# EAGLE design stepper_driver1_c (EAGLE 6.5.0)
stepper conroller with 2 counting bits for unipolar stepper motor
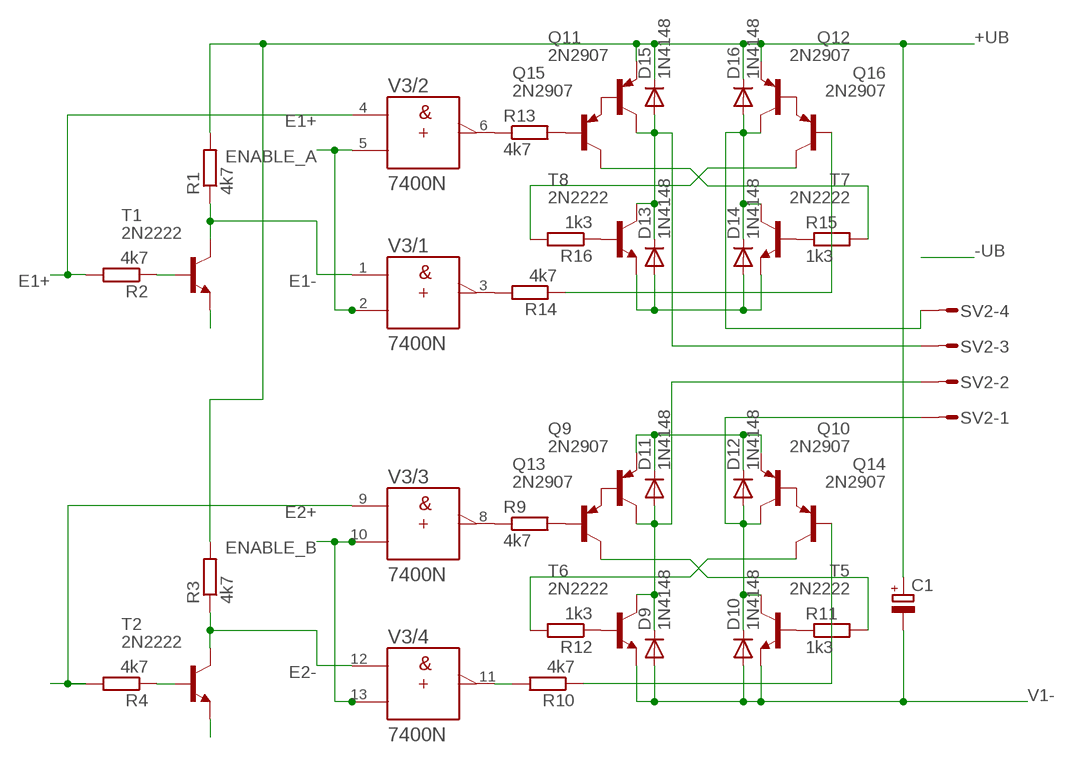
[diagram p0: schematic, sheet 1]

## Parts
C1  CPOL-EUE3.5-10  [E3,5-10]
D9  1N4148  DIODE-D-2.5  [D-2.5]
D10  1N4148  DIODE-D-2.5  [D-2.5]
D11  1N4148  DIODE-D-2.5  [D-2.5]
D12  1N4148  DIODE-D-2.5  [D-2.5]
D13  1N4148  DIODE-D-2.5  [D-2.5]
D14  1N4148  DIODE-D-2.5  [D-2.5]
D15  1N4148  DIODE-D-2.5  [D-2.5]
D16  1N4148  DIODE-D-2.5  [D-2.5]
Q9  2N2907  [TO18]
Q10  2N2907  [TO18]
Q11  2N2907  [TO18]
Q12  2N2907  [TO18]
Q13  2N2907  [TO18]
Q14  2N2907  [TO18]
Q15  2N2907  [TO18]
Q16  2N2907  [TO18]
R1  4k7  R-EU_0207/10  [0207/10]
R2  4k7  R-EU_0207/10  [0207/10]
R3  4k7  R-EU_0207/10  [0207/10]
R4  4k7  R-EU_0207/10  [0207/10]
R9  4k7  R-EU_0207/10  [0207/10]
R10  4k7  R-EU_0207/12  [0207/12]
R11  1k3  R-EU_0207/10  [0207/10]
R12  1k3  R-EU_0207/10  [0207/10]
R13  4k7  R-EU_0207/10  [0207/10]
R14  4k7  R-EU_0207/10  [0207/10]
R15  1k3  R-EU_0207/10  [0207/10]
R16  1k3  R-EU_0207/10  [0207/10]
SV2  S04P  [S04P]
T1  2N2222  [TO18]
T2  2N2222  [TO18]
T5  2N2222  [TO18]
T6  2N2222  [TO18]
T7  2N2222  [TO18]
T8  2N2222  [TO18]
V3  7400N  [DIL14]

## Nets
+UB: C1.+ D11.C D12.C D15.C D16.C Q9.1(E) Q10.1(E) Q11.1(E) Q12.1(E) R1.2 R3.2
-UB: T1.1(E) T2.1(E)
A1+: D13.C D15.A Q11.3(C) SV2.3 T8.3(C)
A1-: D14.C D16.A Q12.3(C) SV2.4 T7.3(C)
A2+: D9.C D11.A Q9.3(C) SV2.2 T6.3(C)
A2-: D10.C D12.A Q10.3(C) SV2.1 T5.3(C)
E1+: R2.2 V3.4(/2:A)
E1-: R1.1 T1.3(C) V3.1(/1:A)
E2+: R4.2 V3.9(/3:A)
E2-: R3.1 T2.3(C) V3.12(/4:A)
ENABLE_A: V3.2(/1:B) V3.5(/2:B)
ENABLE_B: V3.10(/3:B) V3.13(/4:B)
N$1: R4.1 T2.2(B)
N$2: R2.1 T1.2(B)
N$29: Q14.3(C) R12.2
N$30: Q14.2(B) R10.1
N$31: Q13.3(C) R11.2
N$34: R9.1 V3.8(/3:Y)
N$35: R10.2 V3.11(/4:Y)
N$36: Q16.3(C) R16.2
N$37: Q16.2(B) R14.1
N$38: Q15.3(C) R15.2
N$41: R14.2 V3.3(/1:Y)
N$42: R13.1 V3.6(/2:Y)
N$43: R12.1 T6.2(B)
N$44: R11.1 T5.2(B)
N$45: Q9.2(B) Q13.1(E)
N$46: Q10.2(B) Q14.1(E)
N$47: R16.1 T8.2(B)
N$48: R15.1 T7.2(B)
N$49: Q11.2(B) Q15.1(E)
N$50: Q12.2(B) Q16.1(E)
N$51: Q15.2(B) R13.2
N$56: Q13.2(B) R9.2
V1-: C1.- D9.A D10.A D13.A D14.A T5.1(E) T6.1(E) T7.1(E) T8.1(E)

## Power pins joined to a net without a drawn wire
+UB: V3.14(/+UB:+UB)
-UB: V3.7(/-UB:-UB)

## Library data of the parts
C1 = rcl:CPOL-EU: POLARIZED CAPACITOR, European symbol
D9-D16 = diode:DIODE-: DIODE
Q9-Q16 = transistor-pnp:2N2907*: PNP Transistor
R1-R4 R9-R16 = rcl:R-EU_: RESISTOR, European symbol
SV2 = con-amp-mt:S04P: AMP MT CONNECTOR; OC_FARNELL: unknown; OC_NEWARK: unknown
T1 T2 T5-T8 = transistor:2N2222: NPN TRANSISTOR
V3 = 74ttl-din:74*00: Quad 2-input NAND gate

## Board
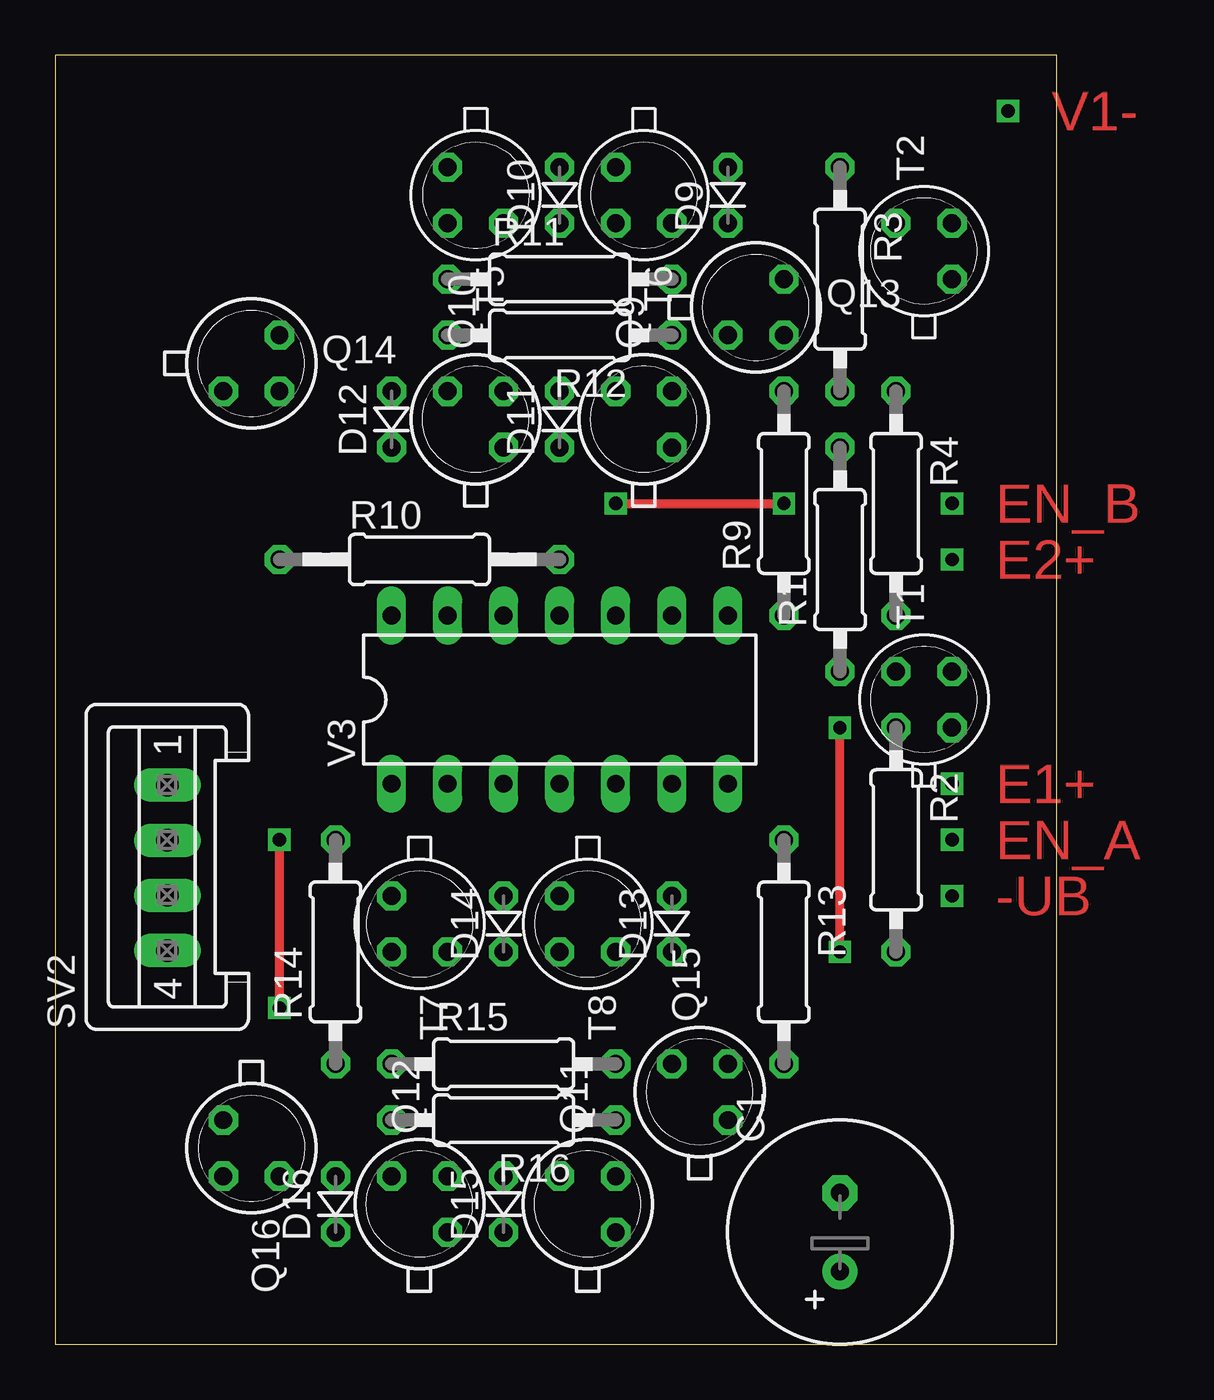
[diagram p1: board, top side]
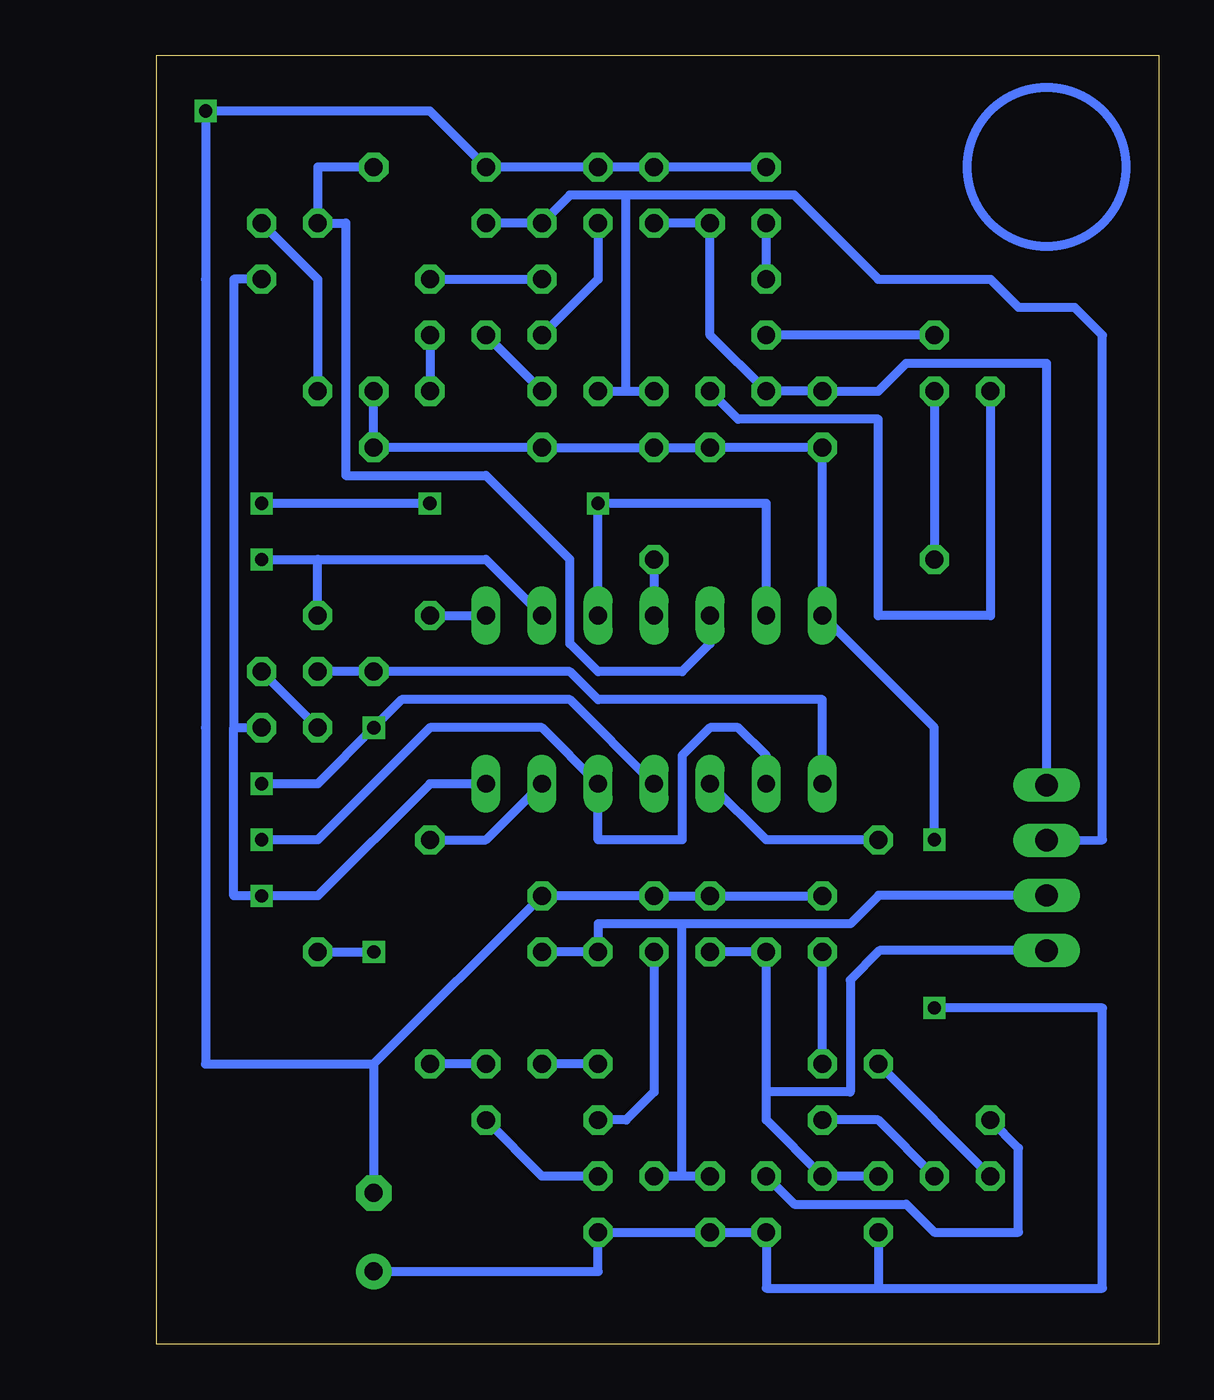
[diagram p2: board, bottom side, seen from below]

Size 45.39 x 58.41 mm. Coordinates in mm from the lower left corner, seen from the top.
Outline: 0,0 45.39,0 45.39,58.41 0,58.41 0,0
Copper layers (1*16): Top 0.035mm / dielectric 1.5mm / Bottom 0.035mm
Design rules "default": minimum track width 10mil, minimum drill 24mil, track to track 8mil, track to pad 8mil, pad to pad 8mil, via to via 8mil, smd to smd 8mil, copper to edge 40mil, drill to drill 8mil, minimum pad ring 10mil, minimum via ring 8mil, stop-mask expansion 4mil, vias tented up to drill 0mil, thermal gap 10mil

### Footprints (pad centres in the part's own frame; a part is rotated, then mirrored left to right if it is on the bottom)
E3,5-10 = drill 0.813 pad 1.6: + -1.778,0 | drill 0.813 pad 1.6 octagon: - 1.778,0
D-2.5 = drill 0.813 octagon: A 1.27,0; C -1.27,0
TO18 = drill 0.813 octagon: 1 -1.27,-1.27; 2 1.27,-1.27; 3 1.27,1.27
0207/10 = drill 0.813 octagon: 1 -5.08,0; 2 5.08,0
0207/12 = drill 0.813 octagon: 1 -6.35,0; 2 6.35,0
S04P = drill 1.016 long: 1 3.75,0; 2 1.25,0; 3 -1.25,0; 4 -3.75,0
DIL14 = drill 0.813 long: 1 -7.62,-3.81; 2 -5.08,-3.81; 3 -2.54,-3.81; 4 0,-3.81; 5 2.54,-3.81; 6 5.08,-3.81; 7 7.62,-3.81; 8 7.62,3.81; 9 5.08,3.81; 10 2.54,3.81; 11 0,3.81; 12 -2.54,3.81; 13 -5.08,3.81; 14 -7.62,3.81

### Placement (x,y rotation side)
C1  35.56,5.08 90 top
D9  30.48,52.07 90 top
D10  22.86,52.07 90 top
D11  22.86,41.91 90 top
D12  15.24,41.91 90 top
D13  27.94,19.05 90 top
D14  20.32,19.05 90 top
D15  20.32,6.35 90 top
D16  12.7,6.35 90 top
Q9  26.67,41.91 90 top
Q10  19.05,41.91 90 top
Q11  24.13,6.35 90 top
Q12  16.51,6.35 90 top
Q13  31.75,46.99 0 top
Q14  8.89,44.45 0 top
Q15  29.21,11.43 90 top
Q16  8.89,8.89 270 top
R1  35.56,35.56 90 top
R2  38.1,22.86 270 top
R3  35.56,48.26 270 top
R4  38.1,38.1 270 top
R9  33.02,38.1 90 top
R10  16.51,35.56 0 top
R11  22.86,48.26 0 top
R12  22.86,45.72 180 top
R13  33.02,17.78 270 top
R14  12.7,17.78 90 top
R15  20.32,12.7 0 top
R16  20.32,10.16 180 top
SV2  5.08,21.59 90 top
T1  39.37,29.21 90 top
T2  39.37,49.53 90 top
T5  19.05,52.07 270 top
T6  26.67,52.07 270 top
T7  16.51,19.05 270 top
T8  24.13,19.05 270 top
V3  22.86,29.21 0 top

### Tracks (layer width: path | path; a pad name or v marks a point on that pad's centre or on a via)
+UB  (via drill 0.6)
  Top 0.406: v10.16,15.24 v10.16,22.86
  Bottom 0.406: 12.7,2.54 17.78,2.54 Q12.1 D15.C Q11.1 25.4,3.3 C1.+ | D16.C 12.7,2.54 | 12.7,2.54 2.54,2.54 2.54,15.24 v10.16,15.24 | v10.16,22.86 10.16,27.94 V3.14 D12.C Q10.1 D11.C Q9.1 R1.2 R3.2
-UB  (via drill 0.6)
  Bottom 0.406: V3.7 33.02,25.4 38.1,20.32 v40.64,20.32 41.91,20.32 41.91,27.94 | T2.1 41.91,48.26 41.91,27.94 | 41.91,27.94 T1.1
A1+
  Bottom 0.406: 21.59,7.62 Q11.3 | D13.C T8.3 25.4,19.05 21.59,19.05 | SV2.3 12.68,20.34 13.97,19.05 21.59,19.05 | D15.A 21.59,7.62 | 21.59,7.62 21.59,19.05
A1-
  Bottom 0.406: D16.A Q12.3 17.78,10.16 17.78,11.43 | D14.C T7.3 17.78,11.43 | SV2.4 12.64,17.84 13.97,16.51 13.97,11.43 17.78,11.43
A2+
  Bottom 0.406: D9.C T6.3 26.67,52.07 24.13,52.07 | 24.13,43.18 D11.A | SV2.2 2.54,22.86 2.54,45.72 3.81,46.99 6.35,46.99 7.62,48.26 12.7,48.26 16.51,52.07 24.13,52.07 | Q9.3 24.13,43.18 | 24.13,43.18 24.13,52.07
A2-
  Bottom 0.406: D10.C T5.3 20.32,45.72 Q10.3 D12.A 12.7,43.18 11.43,44.45 5.08,44.45 SV2.1
E1+  (via drill 0.6)
  Top 0.406: v35.56,17.78 v35.56,27.94
  Bottom 0.406: V3.4 26.67,29.21 34.29,29.21 v35.56,27.94 38.1,25.4 v40.64,25.4 | R2.2 v35.56,17.78
E1-
  Bottom 0.406: V3.1 15.24,29.21 25.4,29.21 26.67,30.48 R1.1 T1.3
E2+  (via drill 0.6)
  Bottom 0.406: v40.64,35.56 38.1,35.56 | 38.1,35.56 30.48,35.56 V3.9 | R4.2 38.1,35.56
E2-
  Bottom 0.406: V3.12 20.32,31.75 21.59,30.48 25.4,30.48 26.67,31.75 26.67,35.56 30.48,39.37 36.83,39.37 36.83,50.8 T2.3 38.1,53.34 R3.1
ENABLE_A  (via drill 0.6)
  Bottom 0.406: v40.64,22.86 38.1,22.86 33.02,27.94 27.94,27.94 V3.5 25.4,22.86 21.59,22.86 21.59,26.67 20.32,27.94 19.05,27.94 17.78,26.67 V3.2
ENABLE_B  (via drill 0.6)
  Top 0.406: v25.4,38.1 v33.02,38.1
  Bottom 0.406: V3.13 17.78,38.1 v25.4,38.1 V3.10 | v33.02,38.1 v40.64,38.1
N$1
  Bottom 0.406: T2.2 38.1,48.26 R4.1
N$2
  Bottom 0.406: T1.2 R2.1
N$29
  Bottom 0.406: Q14.3 R12.2
N$30
  Bottom 0.406: Q14.2 R10.1
N$31
  Bottom 0.406: Q13.3 R11.2
N$34
  Bottom 0.406: R9.1 V3.8
N$35
  Bottom 0.406: R10.2 V3.11
N$36
  Bottom 0.406: Q16.3 12.7,10.16 R16.2
N$37
  Bottom 0.406: Q16.2 R14.1
N$38
  Bottom 0.406: R15.2 Q15.3
N$41
  Bottom 0.406: R14.2 17.78,22.86 V3.3
N$42
  Bottom 0.406: R13.1 30.48,22.86 V3.6
N$43
  Bottom 0.406: T6.2 25.4,48.26 R12.1
N$44
  Bottom 0.406: R11.1 T5.2
N$45
  Bottom 0.406: Q13.1 Q9.2
N$46
  Bottom 0.406: Q14.1 7.62,33.02 12.7,33.02 12.7,41.91 19.05,41.91 Q10.2
N$47
  Bottom 0.406: T8.2 22.86,11.43 24.13,10.16 R16.1
N$48
  Bottom 0.406: R15.1 T7.2
N$49
  Bottom 0.406: Q11.2 27.94,7.62 Q15.1
N$50
  Bottom 0.406: Q12.2 16.51,6.35 11.43,6.35 10.16,5.08 6.35,5.08 6.35,8.89 Q16.1
N$51
  Bottom 0.406: Q15.2 R13.2
N$56
  Bottom 0.406: Q13.2 R9.2
V1-  (via drill 0.6)
  Bottom 0.406: T5.1 D10.A T6.1 D9.A 33.02,55.88 v43.18,55.88 43.18,48.26 43.18,27.94 43.18,12.7 35.56,12.7 | T7.1 D14.A T8.1 D13.A 35.56,12.7 | 35.56,12.7 C1.-
(copper drawn outside any net)
  shapes: Bottom circle x1

### Text on the board
Top: V1- | EN_B | E2+ | E1+ | EN_A | -UB